# EAGLE design magicmouth-v1.0 (EAGLE 6.3)
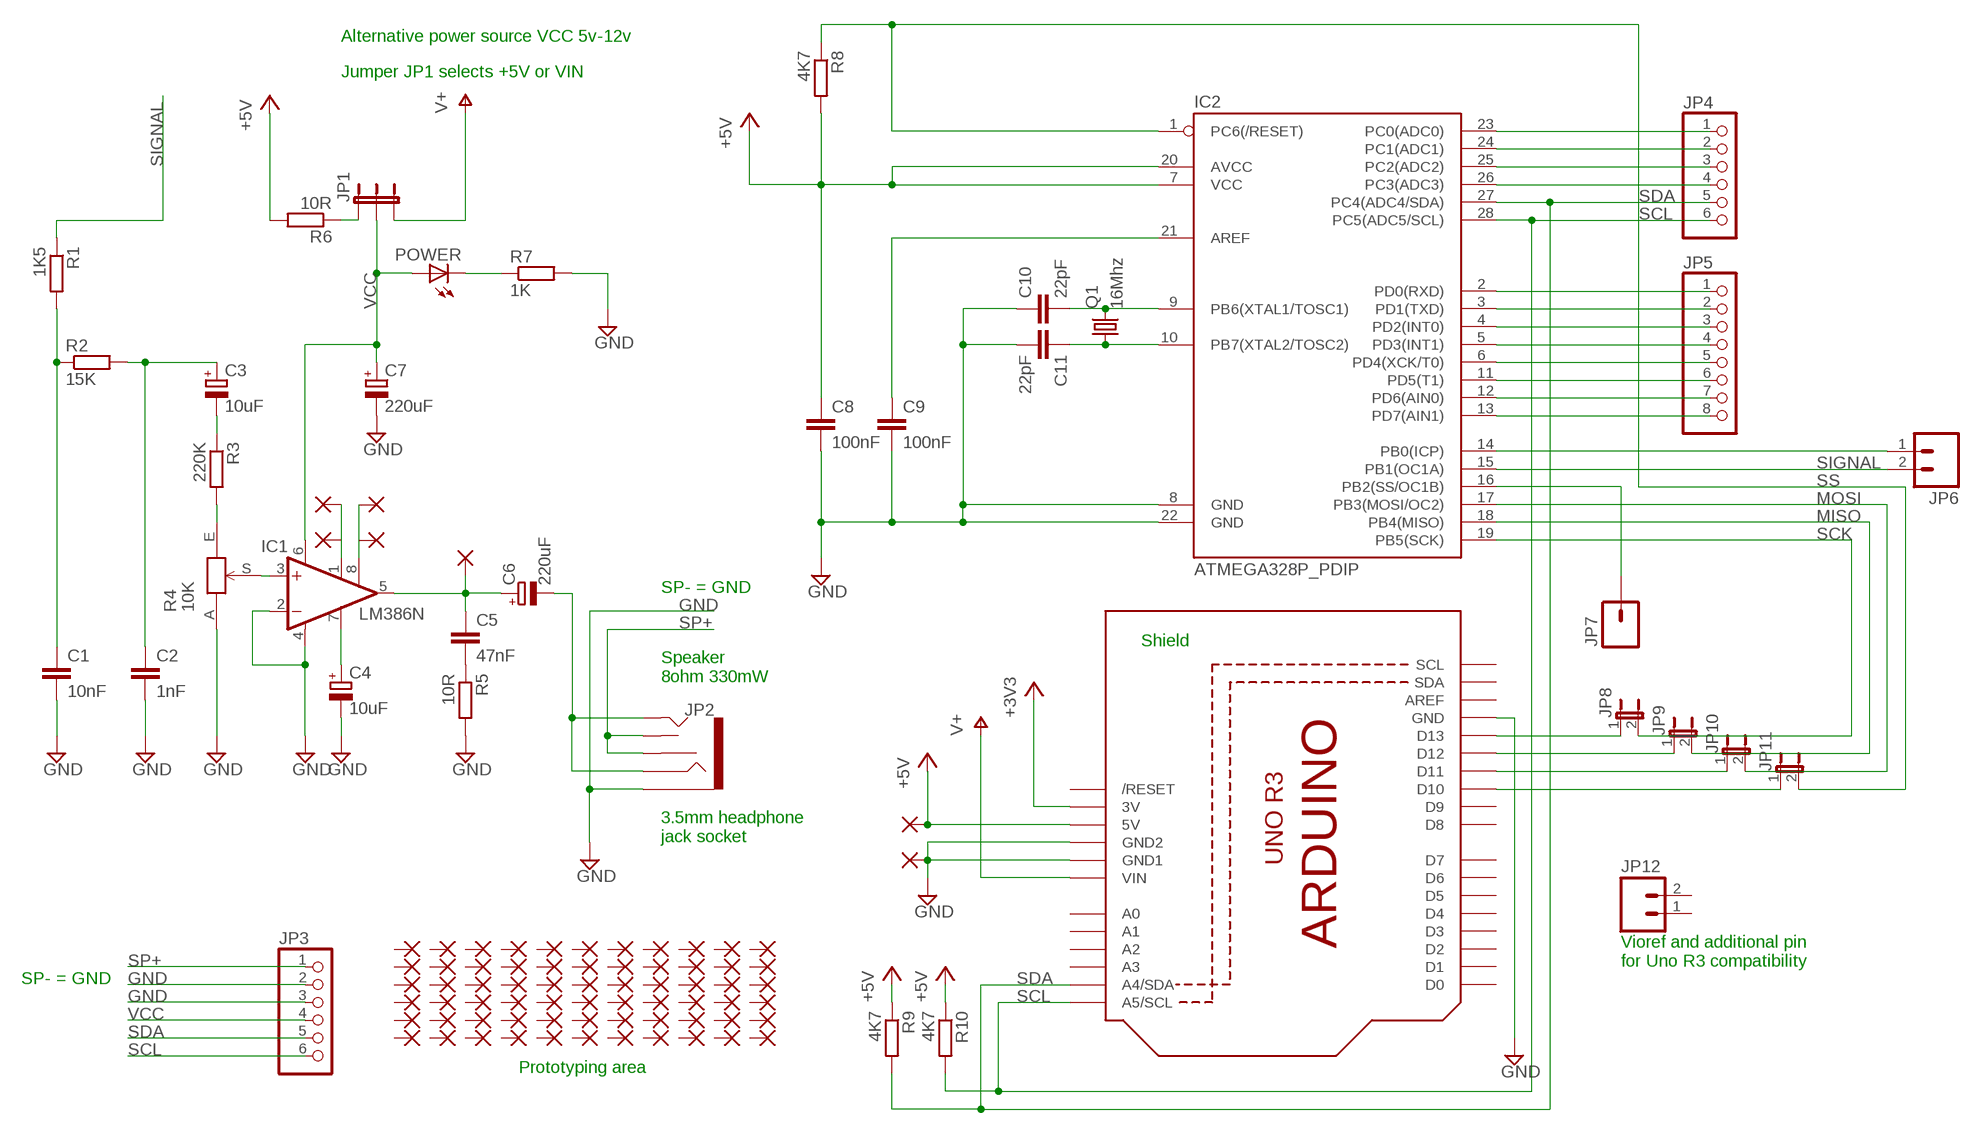
[diagram p0: schematic, sheet 1]

## Parts
C1  10nF  C-EU050-025X075  [C050-025X075]
C2  1nF  C-EU050-025X075  [C050-025X075]
C3  10uF  CPOL-EUE2.5-7  [E2,5-7]
C4  10uF  CPOL-EUE2.5-7  [E2,5-7]
C5  47nF  C-EU050-025X075  [C050-025X075]
C6  220uF  CPOL-EUTT2D7  [TT2D7]
C7  220uF  CPOL-EUTT2D7  [TT2D7]
C8  100nF  C-EU025-025X050  [C025-025X050]
C9  100nF  C-EU025-025X050  [C025-025X050]
C10  22pF  C-EU025-025X050  [C025-025X050]
C11  22pF  C-EU025-025X050  [C025-025X050]
IC1  LM386N  LM386N-1  [DIL08]
IC2  ATMEGA328P_PDIP  [DIL28-3]
JP1  JUMPER-3PTH  [1X03]
JP2  AUDIO-JACK2PTH  [AUDIO-JACK]
JP3  PINHD-1X6CB  [1X06-CLEANBIG]
JP4  PINHD-1X6CB  [1X06-CLEANBIG]
JP5  PINHD-1X8CLEANBIG  [1X08-CLEANBIG]
JP6  M021X02_NO_SILK  [1X02_NO_SILK]
JP7  M01SMDNS  [1X01NS]
JP8  JUMPER-2PTH  [1X02]
JP9  JUMPER-2PTH  [1X02]
JP10  JUMPER-2PTH  [1X02]
JP11  JUMPER-2PTH  [1X02]
JP12  M021X02_NO_SILK  [1X02_NO_SILK]
P1  1,6/0,8  [1,6/0,8]
P5  1,6/0,8  [1,6/0,8]
P8  1,6/0,8  [1,6/0,8]
PAD1  1,6/0,8  [1,6/0,8]
PAD3  1,6/0,8  [1,6/0,8]
PAD7  1,6/0,8  [1,6/0,8]
PAD8  1,6/0,8  [1,6/0,8]
PAD9  1,6/0,8  [1,6/0,8]
PAD10  1,6/0,8  [1,6/0,8]
PAD11  1,6/0,8  [1,6/0,8]
PAD12  1,6/0,8  [1,6/0,8]
PAD13  1,6/0,8  [1,6/0,8]
PAD14  1,6/0,8  [1,6/0,8]
PAD15  1,6/0,8  [1,6/0,8]
PAD16  1,6/0,8  [1,6/0,8]
PAD17  1,6/0,8  [1,6/0,8]
PAD18  1,6/0,8  [1,6/0,8]
PAD19  1,6/0,8  [1,6/0,8]
PAD20  1,6/0,8  [1,6/0,8]
PAD21  1,6/0,8  [1,6/0,8]
PAD22  1,6/0,8  [1,6/0,8]
PAD23  1,6/0,8  [1,6/0,8]
PAD24  1,6/0,8  [1,6/0,8]
PAD25  1,6/0,8  [1,6/0,8]
PAD26  1,6/0,8  [1,6/0,8]
PAD27  1,6/0,8  [1,6/0,8]
PAD28  1,6/0,8  [1,6/0,8]
PAD29  1,6/0,8  [1,6/0,8]
PAD30  1,6/0,8  [1,6/0,8]
PAD31  1,6/0,8  [1,6/0,8]
PAD32  1,6/0,8  [1,6/0,8]
PAD33  1,6/0,8  [1,6/0,8]
PAD34  1,6/0,8  [1,6/0,8]
PAD35  1,6/0,8  [1,6/0,8]
PAD36  1,6/0,8  [1,6/0,8]
PAD37  1,6/0,8  [1,6/0,8]
PAD38  1,6/0,8  [1,6/0,8]
PAD39  1,6/0,8  [1,6/0,8]
PAD40  1,6/0,8  [1,6/0,8]
PAD41  1,6/0,8  [1,6/0,8]
PAD42  1,6/0,8  [1,6/0,8]
PAD43  1,6/0,8  [1,6/0,8]
PAD44  1,6/0,8  [1,6/0,8]
PAD45  1,6/0,8  [1,6/0,8]
PAD46  1,6/0,8  [1,6/0,8]
PAD47  1,6/0,8  [1,6/0,8]
PAD48  1,6/0,8  [1,6/0,8]
PAD49  1,6/0,8  [1,6/0,8]
PAD50  1,6/0,8  [1,6/0,8]
PAD51  1,6/0,8  [1,6/0,8]
PAD52  1,6/0,8  [1,6/0,8]
PAD53  1,6/0,8  [1,6/0,8]
PAD54  1,6/0,8  [1,6/0,8]
PAD55  1,6/0,8  [1,6/0,8]
PAD56  1,6/0,8  [1,6/0,8]
PAD57  1,6/0,8  [1,6/0,8]
PAD58  1,6/0,8  [1,6/0,8]
PAD59  1,6/0,8  [1,6/0,8]
PAD60  1,6/0,8  [1,6/0,8]
PAD61  1,6/0,8  [1,6/0,8]
PAD62  1,6/0,8  [1,6/0,8]
PAD63  1,6/0,8  [1,6/0,8]
PAD64  1,6/0,8  [1,6/0,8]
PAD65  1,6/0,8  [1,6/0,8]
PAD66  1,6/0,8  [1,6/0,8]
PAD67  1,6/0,8  [1,6/0,8]
PAD68  1,6/0,8  [1,6/0,8]
PAD69  1,6/0,8  [1,6/0,8]
PAD70  1,6/0,8  [1,6/0,8]
PAD71  1,6/0,8  [1,6/0,8]
PAD72  1,6/0,8  [1,6/0,8]
PAD73  1,6/0,8  [1,6/0,8]
PAD74  1,6/0,8  [1,6/0,8]
POWER  LED3MM  [LED3MM]
Q1  16Mhz  CRYSTALHC49S  [HC49/S]
R1  1K5  R-EU_0207/7  [0207/7]
R2  15K  R-EU_0207/7  [0207/7]
R3  220K  R-EU_0207/7  [0207/7]
R4  10K  TPOT3352  [3352T]
R5  10R  R-EU_0207/7  [0207/7]
R6  10R  R-EU_0207/7  [0207/7]
R7  1K  R-EU_0207/7  [0207/7]
R8  4K7  R-EU_0207/7  [0207/7]
R9  4K7  R-EU_0207/7  [0207/7]
R10  4K7  R-EU_0207/7  [0207/7]
U1  ARDUINOR3-NOIOREF-NOTEXT  [ARDUINOR3-NOTEXT-NOIOREF]

## Nets
+3V3: U1.3V
+5V: C8.1 IC2.7(VCC) IC2.20(AVCC) PAD55.1(P) R6.2 R8.2 R9.1 R10.1 U1.5V
D8: IC2.14(PB0(ICP)) JP6.1
GND: C1.2 C2.2 C4.- C7.- C8.2 C9.2 C10.1 C11.2 IC1.2(-IN) IC1.4(GND) IC2.8(GND) IC2.22(GND) JP2.SLEEVE JP3.2 JP3.3 PAD68.1(P) R4.A R5.2 R7.2 U1.GND U1.GND1 U1.GND2
MISO: IC2.18(PB4(MISO)) JP9.2
MOSI: IC2.17(PB3(MOSI/OC2)) JP10.2
N$1: C5.1 C6.+ IC1.5(OUT) P5.1(P)
N$2: C1.1 R1.2 R2.1
N$3: C9.1 IC2.21(AREF)
N$4: C5.2 R5.1
N$5: R3.2 R4.E
N$6: C10.2 IC2.9(PB6(XTAL1/TOSC1)) Q1.2
N$7: JP1.1 R6.1
N$8: C6.- JP2.RING JP2.TIP
N$9: IC1.3(+IN) R4.S
N$10: POWER.K(C) R7.1
N$11: C11.1 IC2.10(PB7(XTAL2/TOSC2)) Q1.1
N$12: IC2.16(PB2(SS/OC1B)) JP7.1
N$13: IC2.23(PC0(ADC0)) JP4.1
N$14: C2.1 C3.+ R2.2
N$15: IC2.24(PC1(ADC1)) JP4.2
N$16: IC2.2(PD0(RXD)) JP5.1
N$17: IC2.3(PD1(TXD)) JP5.2
N$18: IC2.4(PD2(INT0)) JP5.3
N$19: IC2.5(PD3(INT1)) JP5.4
N$20: IC2.6(PD4(XCK/T0)) JP5.5
N$21: IC2.11(PD5(T1)) JP5.6
N$22: IC2.12(PD6(AIN0)) JP5.7
N$23: IC2.13(PD7(AIN1)) JP5.8
N$24: C4.+ IC1.7(BYPASS)
N$32: IC2.25(PC2(ADC2)) JP4.3
N$33: IC2.26(PC3(ADC3)) JP4.4
N$58: IC1.1(GAIN) P1.1(P) PAD1.1(P)
N$87: C3.- R3.1
N$90: JP8.1 U1.D13
N$91: JP9.1 U1.D12
N$92: JP10.1 U1.D11
N$93: JP11.1 U1.D10
N$101: IC1.8(GAIN) P8.1(P) PAD3.1(P)
SCK: IC2.19(PB5(SCK)) JP8.2
SCL: IC2.28(PC5(ADC5/SCL)) JP3.6 JP4.6 R10.2 U1.A5(A5/SCL)
SDA: IC2.27(PC4(ADC4/SDA)) JP3.5 JP4.5 R9.2 U1.A4(A4/SDA)
SIGNAL: IC2.15(PB1(OC1A)) JP6.2 R1.1
SP+: JP2.RSH JP2.TSH JP3.1
SS: IC2.1(PC6(/RESET)) JP11.2 R8.1
VCC: C7.+ IC1.6(VS) JP1.2 JP3.4 POWER.A
VIN: JP1.3 U1.VIN ; supply symbol labelled V+
Unconnected: JP12.1 JP12.2 PAD7.1(P) PAD8.1(P) PAD9.1(P) PAD10.1(P) PAD11.1(P) PAD12.1(P) PAD13.1(P) PAD14.1(P) PAD15.1(P) PAD16.1(P) PAD17.1(P) PAD18.1(P) PAD19.1(P) PAD20.1(P) PAD21.1(P) PAD22.1(P) PAD23.1(P) PAD24.1(P) PAD25.1(P) PAD26.1(P) PAD27.1(P) PAD28.1(P) PAD29.1(P) PAD30.1(P) PAD31.1(P) PAD32.1(P) PAD33.1(P) PAD34.1(P) PAD35.1(P) PAD36.1(P) PAD37.1(P) PAD38.1(P) PAD39.1(P) PAD40.1(P) PAD41.1(P) PAD42.1(P) PAD43.1(P) PAD44.1(P) PAD45.1(P) PAD46.1(P) PAD47.1(P) PAD48.1(P) PAD49.1(P) PAD50.1(P) PAD51.1(P) PAD52.1(P) PAD53.1(P) PAD54.1(P) PAD56.1(P) PAD57.1(P) PAD58.1(P) PAD59.1(P) PAD60.1(P) PAD61.1(P) PAD62.1(P) PAD63.1(P) PAD64.1(P) PAD65.1(P) PAD66.1(P) PAD67.1(P) PAD69.1(P) PAD70.1(P) PAD71.1(P) PAD72.1(P) PAD73.1(P) PAD74.1(P) U1.A0 U1.A1 U1.A2 U1.A3 U1.AREF U1.D0 U1.D1 U1.D2 U1.D3 U1.D4 U1.D5 U1.D6 U1.D7 U1.D8 U1.D9 U1.RESET(/RESET) U1.SCL U1.SDA

## Notes on the sheet
- Alternative power source VCC 5v-12v
- Jumper JP1 selects +5V or VIN
- SP- = GND
- Shield
- Speaker
  8ohm 330mW
- 3.5mm headphone
  jack socket
- Vioref and additional pin
  for Uno R3 compatibility
- SP- = GND
- Prototyping area

## Library data of the parts
C1 C2 C5 = rcl:C-EU: CAPACITOR, European symbol
C3 C4 C6 C7 = rcl:CPOL-EU: POLARIZED CAPACITOR, European symbol
C8 = rcl:C-EU: CAPACITOR, European symbol; CAPACITANCE: 10 nF
C9 = rcl:C-EU: CAPACITOR, European symbol; CAPACITANCE: 100 nF
C10 C11 = rcl:C-EU: CAPACITOR, European symbol; CAPACITANCE: 22 pf
IC1 = linear:LM386?-*: Low Voltage Audio Power Amplifier Source: http://cache.national.com/ds/LM/LM386.pdf
IC2 = SparkFun-DigitalIC:ATMEGA328P_PDIP: uC used in the Arduino 32kb flash, 1k EEPROM, 2k SRAM This is the through-hole version of this chip.
JP1 = SparkFun-Passives:JUMPER-3
JP2 = SparkFun-Connectors:AUDIO-JACK2: Stereo audio jack with bypass switches.
JP3 JP4 = adafruit:PINHD-1X6: PIN HEADER
JP5 = adafruit:PINHD-1X8: PIN HEADER
JP6 = SparkFun-Connectors:M02: Header 2 Standard 2-pin 0.1" header. Use with straight break away headers (SKU : PRT-00116), right angle break away headers (PRT-00553), swiss pins (PRT-00743), machine pins (PRT-00117), and female headers (PRT-00115). Molex polarized connector foot print use with SKU : PRT-08233 with associated crimp pins and housings.
JP7 = SparkFun-Connectors:M01: Header 1 Standard 1-pin 0.1" header. Use with straight break away headers (SKU : PRT-00116), right angle break away headers (PRT-00553), swiss pins (PRT-00743), machine pins (PRT-00117), and female headers (PRT-00115).
JP8-JP11 = SparkFun-Passives:JUMPER-2: Jumper Basic 0.1" spaced jumper. Use with breakaway headers.
JP12 = SparkFun:M02: Header 2 Standard 2-pin 0.1" header. Use with straight break away headers (SKU : PRT-00116), right angle break away headers (PRT-00553), swiss pins (PRT-00743), machine pins (PRT-00117), and female headers (PRT-00115). Molex polarized connector foot print use with SKU : PRT-08233 with associated crimp pins and housings.
P1 P5 P8 PAD1 PAD3 PAD7-PAD74 = wirepad:1,6/0,8: THROUGH-HOLE PAD
POWER = led:LED: LED OSRAM: - CHIPLED LG R971, LG N971, LY N971, LG Q971, LY Q971, LO R971, LY R971 LH N974, LH R974 LS Q976, LO Q976, LY Q976 LO Q996 - Hyper CHIPLED LW Q18S LB Q993, LB Q99A, LB R99A - SideLED LS A670, LO A670, LY A670, LG A670, LP A670 LB A673, LV A673, LT A673, LW A673 LH A674 LY A675 LS A676, LA A676, LO A676, LY A676, LW A676 LS A679, LY A679, LG A679 - Hyper Micro SIDELED® LS Y876, LA Y876, LO Y876, LY Y876 LT Y87S - SmartLED LW L88C, LW L88S LB L89C, LB L89S, LG L890 LS L89K, LO L89K, LY L89K LS L896, LA L896, LO L896, LY L896 - TOPLED LS T670, LO T670, LY T670, LG T670, LP T670 LSG T670, LSP T670, LSY T670, LOP T670, LYG T670 LG T671, LOG T671, LSG T671 LB T673, LV T673, LT T673, LW T673 LH T674 LS T676, LA T676, LO T676, LY T676, LB T676, LH T676, LSB T676, LW T676 LB T67C, LV T67C, LT T67C, LS T67K, LO T67K, LY T67K, LW E67C LS E67B, LA E67B, LO E67B, LY E67B, LB E67C, LV E67C, LT E67C LW T67C LS T679, LY T679, LG T679 LS T770, LO T770, LY T770, LG T770, LP T770 LB T773, LV T773, LT T773, LW T773 LH T774 LS E675, LA E675, LY E675, LS T675 LS T776, LA T776, LO T776, LY T776, LB T776 LHGB T686 LT T68C, LB T68C - Hyper Mini TOPLED® LB M676 - Mini TOPLED Santana® LG M470 LS M47K, LO M47K, LY M47K Source: http://www.osram.convergy.de - LUMILED® LXK2-PW12-R00, LXK2-PW12-S00, LXK2-PW14-U00, LXK2-PW14-V00 LXK2-PM12-R00, LXK2-PM12-S00, LXK2-PM14-U00 LXK2-PE12-Q00, LXK2-PE12-R00, LXK2-PE12-S00, LXK2-PE14-T00, LXK2-PE14-U00 LXK2-PB12-K00, LXK2-PB12-L00, LXK2-PB12-M00, LXK2-PB14-N00, LXK2-PB14-P00, LXK2-PB14-Q00 LXK2-PR12-L00, LXK2-PR12-M00, LXK2-PR14-Q00, LXK2-PR14-R00 LXK2-PD12-Q00, LXK2-PD12-R00, LXK2-PD12-S00 LXK2-PH12-R00, LXK2-PH12-S00 LXK2-PL12-P00, LXK2-PL12-Q00, LXK2-PL12-R00 Source: www.luxeon.com
Q1 = crystal:CRYSTAL: CRYSTAL; OC_FARNELL: 1667008; OC_NEWARK: unknown
R1 R2 R6 R7 = rcl:R-EU_: RESISTOR, European symbol
R3 R5 = resistor:R-EU_: RESISTOR, European symbol
R4 = t0mpr1c3:TPOT: Bourns thumbwheel trimmer resistor
R8-R10 = rcl:R-EU_: RESISTOR, European symbol; RESISTANCE: 4K7
U1 = adafruit:ARDUINOR3-NOIOREF

## Board
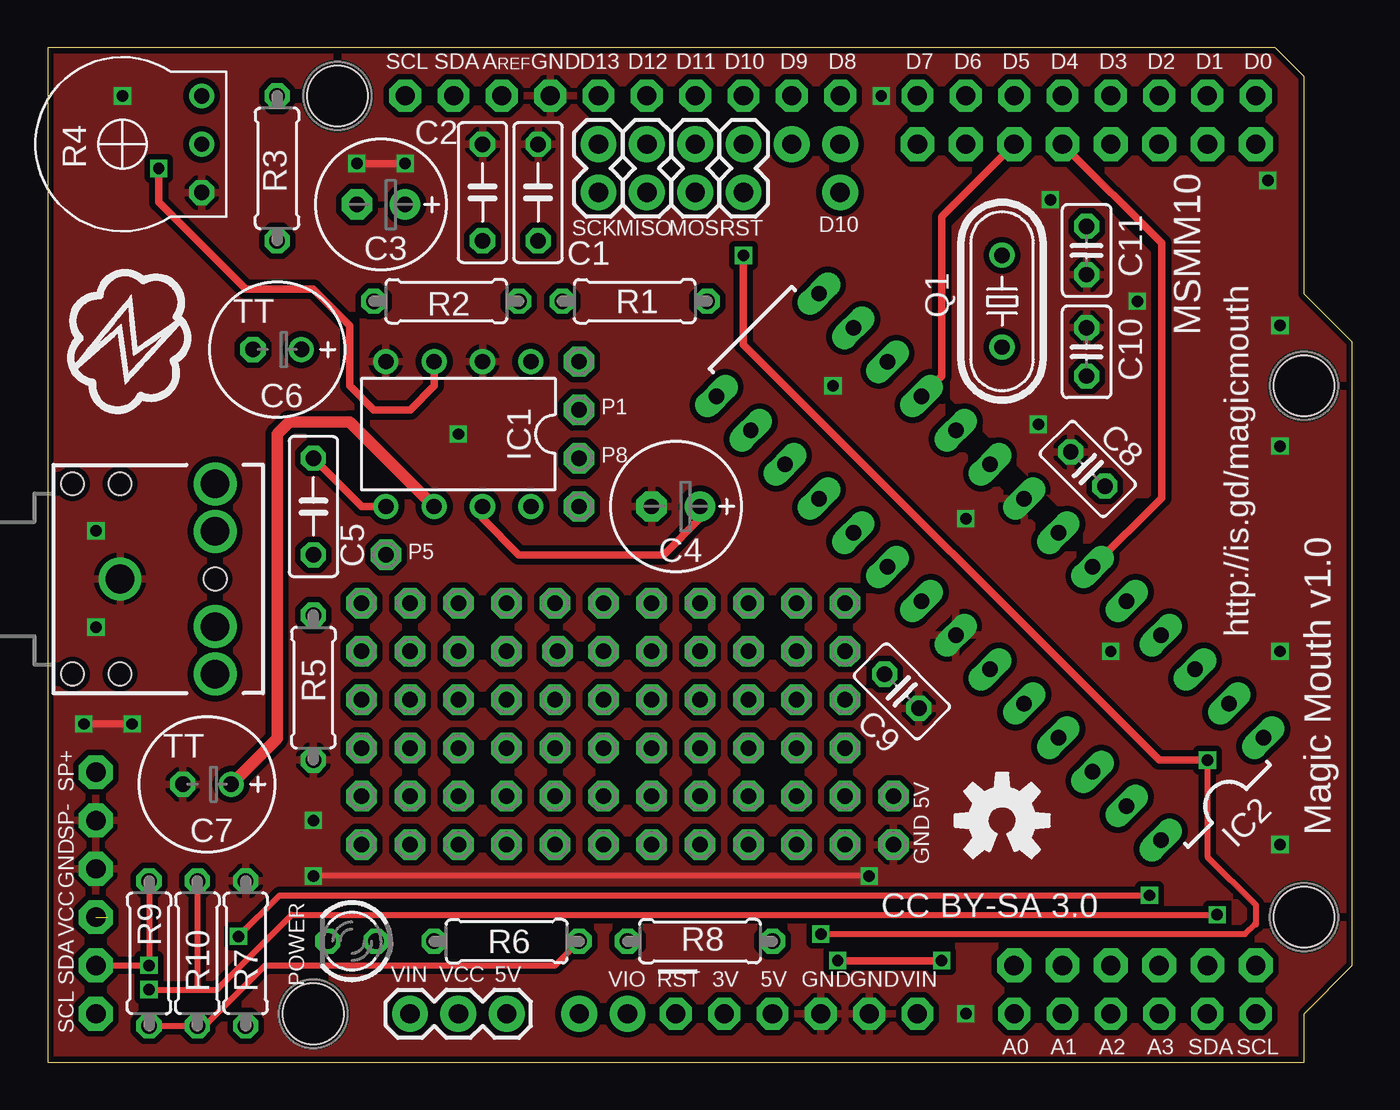
[diagram p1: board, top side]
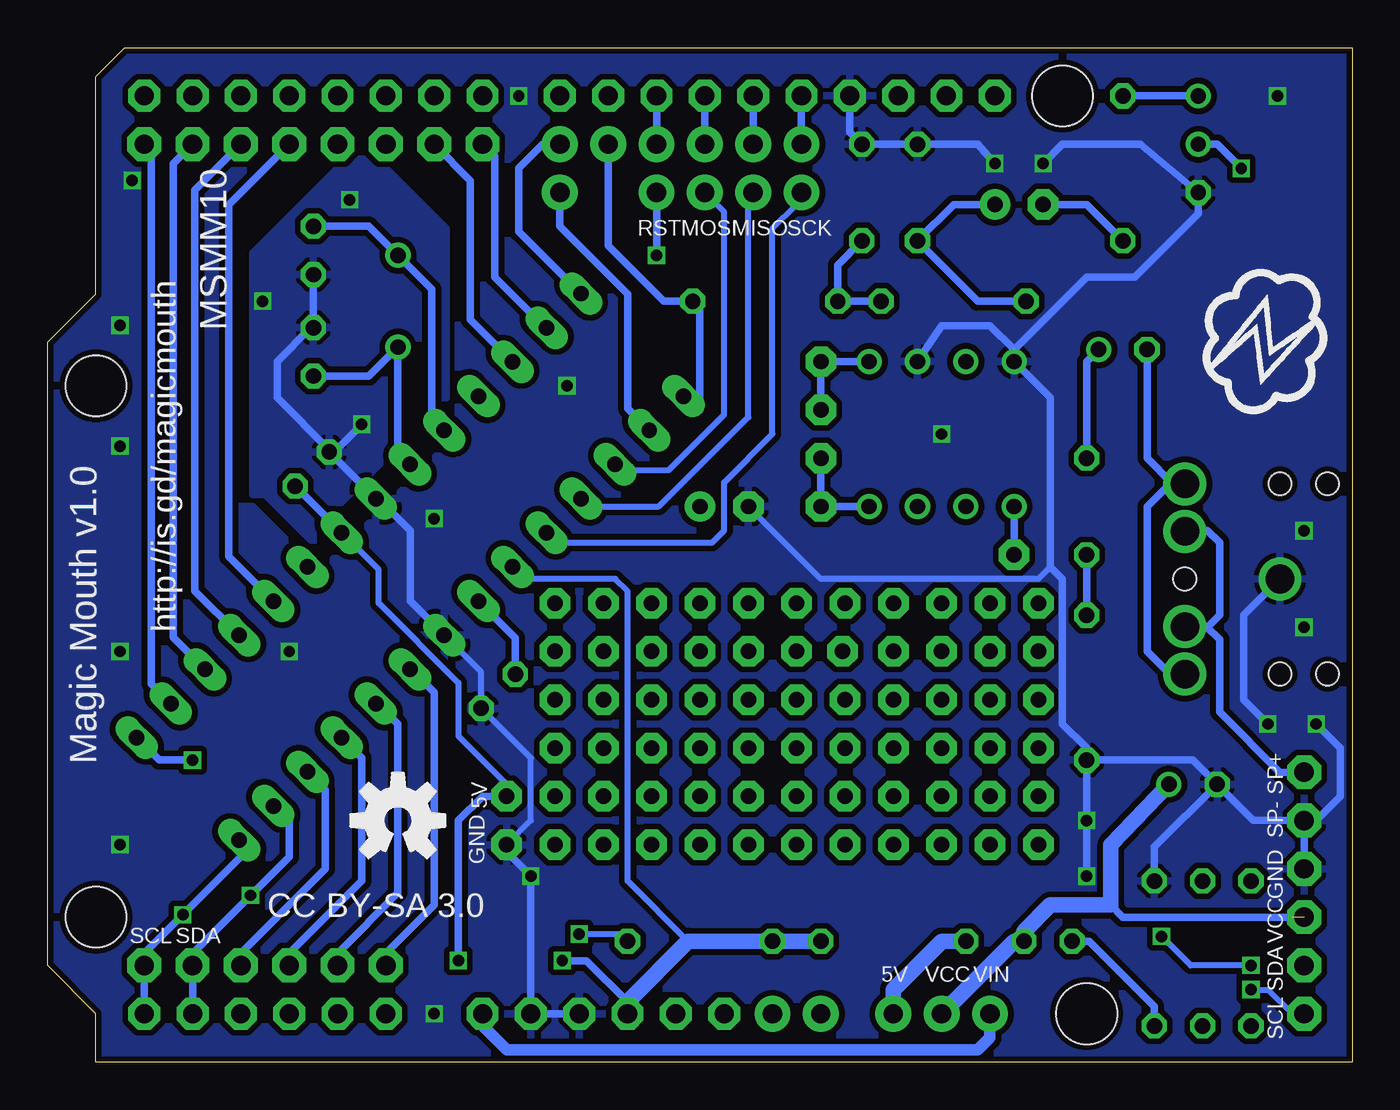
[diagram p2: board, bottom side, seen from below]

Size 68.58 x 53.34 mm. Coordinates in mm from the lower left corner, seen from the top.
Outline: 0,0 66.04,0 66.04,2.54 68.58,5.08 68.58,37.85 66.04,40.39 66.04,51.82 64.52,53.34 0,53.33 0,0
Copper layers (1*16): Top 0.035mm / dielectric 1.5mm / Bottom 0.035mm
Design rules "Fusion_eagle_rule_v1.1": minimum track width 6mil, minimum drill 12mil, track to track 6mil, track to pad 6mil, pad to pad 6mil, via to via 6mil, smd to smd 0mil, copper to edge 10mil, drill to drill 10mil, minimum pad ring 10mil, minimum via ring 6mil, stop-mask expansion 2mil, vias tented up to drill 100mil, thermal gap 10mil
Holes 3.2 mm at 66.04,35.56 66.04,7.62 13.97,2.54 15.24,50.8

### Footprints (pad centres in the part's own frame; a part is rotated, then mirrored left to right if it is on the bottom)
C050-025X075 = drill 0.813 octagon: 1 -2.54,0; 2 2.54,0
E2,5-7 = drill 0.813 pad 1.6: + -1.27,0 | drill 0.813 pad 1.6 octagon: - 1.27,0
TT2D7 = drill 0.813: + -1.27,0 | drill 0.813 octagon: - 1.27,0
C025-025X050 = drill 0.813 octagon: 1 -1.27,0; 2 1.27,0
DIL08 = drill 0.813 pad 1.27: 1 -3.81,-3.81; 2 -1.27,-3.81; 3 1.27,-3.81; 4 3.81,-3.81; 5 3.81,3.81; 6 1.27,3.81; 7 -1.27,3.81; 8 -3.81,3.81
DIL28-3 = drill 0.813 long: 1 -16.51,-3.81; 2 -13.97,-3.81; 3 -11.43,-3.81; 4 -8.89,-3.81; 5 -6.35,-3.81; 6 -3.81,-3.81; 7 -1.27,-3.81; 8 1.27,-3.81; 9 3.81,-3.81; 10 6.35,-3.81; 11 8.89,-3.81; 12 11.43,-3.81; 13 13.97,-3.81; 14 16.51,-3.81; 15 16.51,3.81; 16 13.97,3.81; 17 11.43,3.81; 18 8.89,3.81; 19 6.35,3.81; 20 3.81,3.81; 21 1.27,3.81; 22 -1.27,3.81; 23 -3.81,3.81; 24 -6.35,3.81; 25 -8.89,3.81; 26 -11.43,3.81; 27 -13.97,3.81; 28 -16.51,3.81
1X03 = drill 1.016 pad 1.88: 1 0,0; 2 2.54,0; 3 5.08,0
AUDIO-JACK = drill 1.5 pad 2.184: RING 5,5; RSH 5,2.5; SLEEVE 0,0; TIP 5,-5; TSH 5,-2.5 | hole 1.2: 0,5; -2.5,5; -2.5,-5; 0,-5; 5,0
1X06-CLEANBIG = drill 1.016 pad 1.778 octagon: 1 -6.35,0; 2 -3.81,0; 3 -1.27,0; 4 1.27,0; 5 3.81,0; 6 6.35,0
1X08-CLEANBIG = drill 1.016 pad 1.778 octagon: 1 -8.89,0; 2 -6.35,0; 3 -3.81,0; 4 -1.27,0; 5 1.27,0; 6 3.81,0; 7 6.35,0; 8 8.89,0
1X02_NO_SILK = drill 1.016 pad 1.88: 1 0,0; 2 2.54,0
1X01NS = drill 1.016 pad 1.88: 1 0,0
1X02 = drill 1.016 pad 1.88: 1 0,0; 2 2.54,0
1,6/0,8 = drill 0.813 pad 1.6 octagon: 1 0,0
LED3MM = drill 0.813 octagon: A -1.27,0; K 1.27,0
HC49/S = drill 0.813: 1 -2.413,0; 2 2.413,0
0207/7 = drill 0.813 octagon: 1 -3.81,0; 2 3.81,0
3352T = drill 0.8 pad 1.27 octagon: A -2.54,-4.16 | drill 0.8 pad 1.27: E 2.54,-4.16; S 0,-4.16
ARDUINOR3-NOTEXT-NOIOREF = drill 1 pad 1.676 octagon: 3V 35.56,2.54; 5V 38.1,2.54; A0 50.8,2.54; A1 53.34,2.54; A2 55.88,2.54; A3 58.42,2.54; A4 60.96,2.54; A5 63.5,2.54; AREF 23.876,50.8; D0 63.5,50.8; D1 60.96,50.8; D2 58.42,50.8; D3 55.88,50.8; D4 53.34,50.8; D5 50.8,50.8; D6 48.26,50.8; D7 45.72,50.8; D8 41.656,50.8; D9 39.116,50.8; D10 36.576,50.8; D11 34.036,50.8; D12 31.496,50.8; D13 28.956,50.8; GND 26.416,50.8; GND1 43.18,2.54; GND2 40.64,2.54; RESET 33.02,2.54; SCL 18.796,50.8; SDA 21.336,50.8; VIN 45.72,2.54

### Placement (x,y rotation side)
C1  25.78,45.72 90 top
C2  22.86,45.72 90 top
C3  17.53,45.09 180 top
C4  33.02,29.21 180 top
C5  13.97,29.21 270 top
C6  12.06,37.47 180 top
C7  8.38,14.61 180 top
C8  54.67,31.18 135 top
C9  44.89,19.49 315 top
C10  54.61,37.34 270 top
C11  54.61,42.67 270 top
IC1  21.59,33.02 180 top
IC2  49.53,26.04 135 top
JP1  24.13,2.54 180 top
JP2  3.81,25.4 0 top
JP3  2.54,8.89 270 top
JP4  57.15,5.08 0 top
JP5  54.61,48.26 180 top
JP6  41.66,48.26 180 top
JP7  41.66,45.72 180 top
JP8  28.96,48.26 270 top
JP9  31.5,48.26 270 top
JP10  34.04,48.26 270 top
JP11  36.58,48.26 270 top
JP12  27.94,2.54 0 top
P1  27.94,34.29 0 top
P5  17.78,26.67 0 top
P8  27.94,31.75 0 top
PAD1  27.94,36.83 0 top
PAD3  27.94,29.21 0 top
PAD7  16.51,11.43 0 top
PAD8  19.05,11.43 0 top
PAD9  39.37,24.13 0 top
PAD10  41.91,24.13 0 top
PAD11  41.91,21.59 0 top
PAD12  39.37,21.59 0 top
PAD13  39.37,19.05 0 top
PAD14  39.37,16.51 0 top
PAD15  39.37,13.97 0 top
PAD16  39.37,11.43 0 top
PAD17  41.91,19.05 0 top
PAD18  41.91,11.43 0 top
PAD19  41.91,13.97 0 top
PAD20  41.91,16.51 0 top
PAD21  21.59,11.43 0 top
PAD22  24.13,11.43 0 top
PAD23  26.67,11.43 0 top
PAD24  29.21,11.43 0 top
PAD25  31.75,11.43 0 top
PAD26  36.83,11.43 0 top
PAD27  36.83,21.59 0 top
PAD28  16.51,16.51 0 top
PAD29  36.83,13.97 90 top
PAD30  36.83,24.13 90 top
PAD31  19.05,13.97 90 top
PAD32  19.05,16.51 90 top
PAD33  24.13,16.51 90 top
PAD34  21.59,13.97 90 top
PAD35  21.59,16.51 90 top
PAD36  26.67,16.51 90 top
PAD37  24.13,13.97 90 top
PAD38  29.21,13.97 90 top
PAD39  29.21,16.51 90 top
PAD40  16.51,13.97 90 top
PAD41  36.83,16.51 90 top
PAD42  31.75,16.51 90 top
PAD43  26.67,13.97 90 top
PAD44  34.29,13.97 90 top
PAD45  36.83,19.05 90 top
PAD46  34.29,11.43 90 top
PAD47  31.75,13.97 90 top
PAD48  34.29,16.51 90 top
PAD49  31.75,24.13 90 top
PAD50  34.29,24.13 90 top
PAD51  19.05,21.59 90 top
PAD52  34.29,21.59 90 top
PAD53  34.29,19.05 90 top
PAD54  19.05,19.05 90 top
PAD55  44.45,13.97 0 top
PAD56  29.21,24.13 90 top
PAD57  16.51,19.05 90 top
PAD58  16.51,24.13 90 top
PAD59  16.51,21.59 90 top
PAD60  21.59,21.59 90 top
PAD61  19.05,24.13 90 top
PAD62  21.59,24.13 90 top
PAD63  24.13,19.05 90 top
PAD64  24.13,24.13 90 top
PAD65  24.13,21.59 90 top
PAD66  21.59,19.05 90 top
PAD67  26.67,24.13 90 top
PAD68  44.45,11.43 0 top
PAD69  26.67,19.05 90 top
PAD70  29.21,19.05 90 top
PAD71  31.75,19.05 90 top
PAD72  26.8,21.59 90 top
PAD73  29.21,21.59 90 top
PAD74  31.75,21.59 90 top
POWER  16,6.35 180 top
Q1  50.16,40.01 270 top
R1  30.86,40.01 180 top
R2  20.95,40.01 180 top
R3  12.06,46.99 90 top
R4  3.94,48.26 90 top
R5  13.97,19.68 270 top
R6  24.13,6.35 0 top
R7  10.41,5.71 90 top
R8  34.29,6.35 180 top
R9  5.33,5.71 90 top
R10  7.87,5.71 90 top
U1  0,0 0 top
U$1  [OSHW-LOGO-M]  50.16,12.7 0 top
U$2  [OSHW-LOGO-M]  50.16,12.7 0 bottom

### Tracks (layer width: path | path; a pad name or v marks a point on that pad's centre or on a via)
+5V  (via drill 0.6)
  Top 0.305: R9.1 R10.1 8.26,1.91 11.43,5.08 26.67,5.08 R6.2
  Top 0.406: v46.99,5.33 v41.53,5.33
  Bottom 0.308: 44.45,14.61 46.99,17.14 46.99,19.94 51.18,24.13 51.18,25.89 IC2.7 | 34.92,6.35 38.1,9.53 38.1,24.77 38.73,25.4 43.51,25.4 IC2.20
  Bottom 0.406: v46.99,5.33 46.99,12.7 45.72,13.97 PAD55.1 44.45,14.61 | 38.1,3.17 40.26,5.33 v41.53,5.33 | C8.1 IC2.7
  Bottom 0.813: U1.5V 38.1,3.17 34.92,6.35 R8.2 R6.2
D8
  Bottom 0.406: IC2.14 43.81,43.67 43.81,46.99 42.55,48.26 JP6.1
GND  (via drill 0.6, 0.6 pad 0.3)
  Top 0.308: v43.18,9.78 v13.97,9.78
  Top 0.406: v4.45,17.78 v1.91,17.78 | v18.8,47.24 v16.26,47.24
  Bottom 0.305: PAD68.1 43.18,12.7 43.18,15.98 C9.2 45.79,20.5 IC2.22
  Bottom 0.308: C4.- 27.94,25.4 16.51,25.4 15.88,26.04
  Bottom 0.406: v1.91,17.78 0.64,16.51 0.64,13.97 1.91,12.7 JP3.2 | JP3.2 JP3.3 | v13.97,9.78 v13.97,12.7 R5.2 | U1.GND 26.42,48.9 C1.2 C2.2 19.68,48.26 v18.8,47.24 | R5.2 13.97,16.51 15.24,17.78 15.24,25.4 15.88,26.04 15.88,34.92 IC1.4 17.78,37.47 | v4.45,17.78 5.71,19.05 5.71,23.5 JP2.SLEEVE | C11.2 C10.1 54.74,38.61 56.52,36.83 56.52,34.92 53.77,32.19 53.41,32.19 v52.07,33.53 | C8.2 IC2.8 51.22,29.63 49.53,27.94 49.53,24.24 IC2.22 | U1.GND2 U1.GND1 v43.18,9.78 44.45,11.05 PAD68.1 | IC1.2 21.59,38.73 19.05,38.73 17.78,37.47 | v16.26,47.24 15.24,48.26 11.14,48.26 R4.A 8.1,44.61 11.43,41.27 13.97,41.27 17.78,37.47 | JP3.2 5.21,12.7 C7.- | R5.2 8.38,15.88 C7.- | R7.2 10.41,11.3 C7.-
  other vias: 57.28,40.01 52.7,45.34 64.77,38.73 64.77,32.38 64.77,11.43 3.94,50.8 41.27,35.56 2.54,27.94 2.54,22.86 55.88,21.59 21.59,33.02 48.26,2.54 48.26,28.57 43.81,50.8 64.77,21.59 64.14,46.35
  pour Bottom (isolate 0.305): 66.04,2.54 68.58,5.08 68.58,37.85 66.04,40.39 66.04,51.82 64.52,53.34 53.34,53.34 53.34,48.26 52.7,47.62 53.34,47.62 58.42,42.55 58.42,29.21 57.78,29.21 54.61,26.04 53.98,26.04 46.99,33.02 0,33.02 0,0 66.04,0
  pour Top (isolate 0.305): 0,0 0,33.02 46.99,33.02 53.34,26.67 55.88,26.67 58.42,29.21 58.42,43.18 53.34,48.26 53.34,53.34 64.52,53.34 66.04,51.82 66.04,40.39 68.58,37.85 68.58,5.08 66.04,2.54 66.04,0
  pour Bottom (isolate 0.305): 0,53.34 0,33.02 46.99,33.02 46.99,44.45 50.8,48.26 53.34,48.26 53.34,52.7 52.7,53.34
  pour Top (isolate 0.305): 0,33.02 46.99,33.02 46.99,44.45 50.8,48.26 53.34,48.26 53.34,53.34 0,53.34
  pour Bottom (isolate 0.305): 47.62,34.92 47.62,43.81 51.44,47.62 52.7,47.62 57.78,42.55 57.78,29.84 57.15,29.84 54.61,27.3 54.61,27.94
  pour Top (isolate 0.305): 51.44,47.62 52.7,47.62 57.78,42.55 57.78,29.84 57.15,29.84 54.61,27.3 54.61,27.94 47.62,34.92 47.62,43.81
MISO
  Bottom 0.308: IC2.18 40.42,29.63 40.01,29.21 36.45,29.21 31.75,33.91 31.75,45.47 JP9.2
MOSI
  Bottom 0.308: JP10.2 33.02,44.7 33.02,34.04 35.94,31.11 38.45,31.11 IC2.17
N$1
  Top 0.406: IC1.5 16.51,29.21 C5.1
  Bottom 0.406: C5.1 13.97,36.83 C6.+ | P5.1 IC1.5
N$2
  Bottom 0.406: C1.1 27.05,41.91 R1.2 R2.1
N$3
  Bottom 0.406: C9.1 44,22.3 IC2.21
N$4
  Bottom 0.406: C5.2 R5.1
N$5
  Bottom 0.406: R4.E R3.2
N$6
  Bottom 0.406: C10.2 51.69,36.07 Q1.2 50.16,32.06 IC2.9
N$7
  Bottom 0.813: R6.1 21.59,6.35 24.13,3.81 JP1.1
N$8
  Bottom 0.406: JP2.TIP 8.89,20.32 9.53,20.32 10.79,21.59 10.79,29.21 9.53,30.48 | 9.53,30.48 8.89,30.48 JP2.RING | C6.- 10.79,31.75 9.53,30.48
N$9  (via drill 0.6)
  Top 0.406: v5.84,46.99 5.84,45.21 10.41,40.64 13.97,40.64 15.88,38.73 15.88,35.56 17.14,34.29 19.05,34.29 20.32,35.56 IC1.3
  Bottom 0.406: R4.S 7.11,48.26 v5.84,46.99
N$10
  Bottom 0.406: POWER.K 13.84,6.35 10.41,2.92 R7.1
N$11
  Bottom 0.406: C11.1 51.69,43.94 Q1.1 48.39,40.64 48.39,33.87 IC2.10
N$12
  Bottom 0.406: JP7.1 41.66,43.94 38.1,40.39 38.1,34.36 IC2.16
N$13
  Bottom 0.406: JP4.1 50.8,5.71 48.26,8.26 48.26,19.43 49.48,20.65 IC2.23
N$14
  Bottom 0.406: R2.2 19.68,40.01 C2.1 20.95,45.09 C3.+
N$15
  Bottom 0.406: JP4.2 53.34,5.71 50.16,8.89 50.16,17.78 51.24,18.85 IC2.24
N$16
  Bottom 0.406: JP5.1 63.12,47.88 63.12,19.87 IC2.2
N$17
  Bottom 0.406: JP5.2 61.98,47.24 61.98,22.32 IC2.3
N$18
  Bottom 0.406: JP5.3 60.83,45.85 60.83,24.77 IC2.4
N$19
  Bottom 0.406: JP5.4 59.05,45.09 59.05,26.58 IC2.5
N$20
  Top 0.406: IC2.6 58.55,29.66 58.55,43.05 JP5.5
N$21
  Top 0.406: IC2.11 46.99,36.07 46.99,44.45 JP5.6
N$22
  Bottom 0.406: JP5.7 46.35,46.35 46.35,39.02 IC2.12
N$23
  Bottom 0.406: IC2.13 42.42,38.61 45.09,41.27 45.09,47.62 JP5.8
N$24
  Top 0.406: IC1.7 22.86,28.57 24.77,26.67 32.38,26.67 34.29,28.57 C4.+
N$32
  Bottom 0.406: JP4.3 55.88,5.71 52.07,9.53 52.07,16 IC2.25
N$33
  Bottom 0.406: JP4.4 58.42,5.71 53.98,10.16 53.98,14.32 IC2.26
N$58
  Bottom 0.406: P1.1 PAD1.1 IC1.1
N$87
  Bottom 0.406: C3.- 13.97,45.09 R3.1
N$90
  Bottom 0.406: U1.D13 JP8.1
N$91
  Bottom 0.406: U1.D12 JP9.1
N$92
  Bottom 0.406: U1.D11 JP10.1
N$93
  Bottom 0.406: U1.D10 JP11.1
N$101
  Bottom 0.406: IC1.8 PAD3.1 P8.1
SCK
  Bottom 0.308: IC2.19 42.35,27.74 41.91,27.3 33.66,27.3 33.02,27.94 33.02,30.48 30.48,33.02 30.48,43.81 29.21,45.09 29.21,45.47 JP8.2
SCL  (via drill 0.6)
  Top 0.305: v5.33,3.81 7.87,3.81 | 7.87,3.81 8.89,3.81 | R10.2 7.87,3.81
  Top 0.308: v61.47,7.75 12.83,7.75 8.89,3.81
  Bottom 0.305: v5.33,3.81 4.45,3.81 3.17,2.54 JP3.6
  Bottom 0.406: 58.42,11.43 58.42,10.79 v61.47,7.75 63.5,5.71 JP4.6 U1.A5 | 58.42,11.43 58.42,11.58 | IC2.28 58.51,11.52 58.42,11.43
SDA  (via drill 0.6)
  Top 0.305: JP3.5 v5.33,5.08 R9.2 | v10.03,6.6 12.19,8.76
  Top 0.308: 12.19,8.76 v57.91,8.76
  Bottom 0.305: v5.33,5.08 8.51,5.08 v10.03,6.6
  Bottom 0.406: IC2.27 56.64,13.46 55.88,12.7 55.88,10.79 v57.91,8.76 60.96,5.71 JP4.5 U1.A4
SIGNAL
  Bottom 0.406: JP6.2 39.12,42.93 36.2,40.01 R1.1 34.29,39.62 34.29,34.29 34.44,34.29 IC2.15
SP+
  Bottom 0.406: 7.62,22.86 8.77,22.86 JP2.TSH 7.58,22.9 | JP2.RSH 8.77,27.94 7.62,27.94 6.99,27.3 6.99,23.5 7.62,22.86 | 3.17,15.24 JP3.1 3.81,15.24 6.99,18.41 6.99,22.23 7.62,22.86
SS  (via drill 0.6)
  Top 0.308: v40.64,6.73 62.93,6.73 63.44,7.24 63.5,7.24 63.5,8.26 60.96,10.79 v60.96,15.88
  Top 0.406: v36.58,42.42 36.58,37.72 58.42,15.88 v60.96,15.88
  Bottom 0.308: v40.64,6.73 38.48,6.73 R8.1
  Bottom 0.406: JP11.2 v36.58,42.42 | v60.96,15.88 62.72,15.88 IC2.1
VCC  (1 unrouted)
  Top 0.61: IC1.6 15.88,33.66 12.7,33.66 12.06,33.02 12.06,17.02 C7.+
  Bottom 0.406: 3.3,7.62 3.17,7.62 | 12.7,8.26 12.06,7.62 JP3.4
  Bottom 0.813: C7.+ 12.7,11.43 12.7,8.26 15.88,8.26 17.27,6.86 POWER.A 17.78,6.35 JP1.2
VIN
  Bottom 0.61: U1.VIN 45.72,1.91 44.45,0.64 19.68,0.64 19.05,1.27 JP1.3

### Text on the board
tPlace: SCL | SDA | A | REF | GND | D13 | D12 | D11 | D10 | D9 | D8 | D7 | D6 | D5 | D4 | D3 | D2 | D1 | D0 | D10 | SCK | MISO | MOSI | RST | MSMM10 | http://is.gd/magicmouth | SP+ | 5V | SP- | Magic Mouth v1.0 | GND | GND | CC BY-SA 3.0 | VCC | _ | SDA | VIN | VCC | 5V | VIO | RST | 3V | 5V | GND | GND | VIN | SCL | A0 | A1 | A2 | A3 | SDA | SCL
bPlace: SCK | MISO | MOSI | RST | MSMM10 | Magic Mouth v1.0 | http://is.gd/magicmouth | SP+ | SP- | 5V | GND | GND | VCC | CC BY-SA 3.0 | SDA | SDA | SCL | VIN | VCC | 5V | SCL